# Altium schematic sheet Sheet1.SchDoc
size A; SheetNumber: 1; SheetTotal: 1
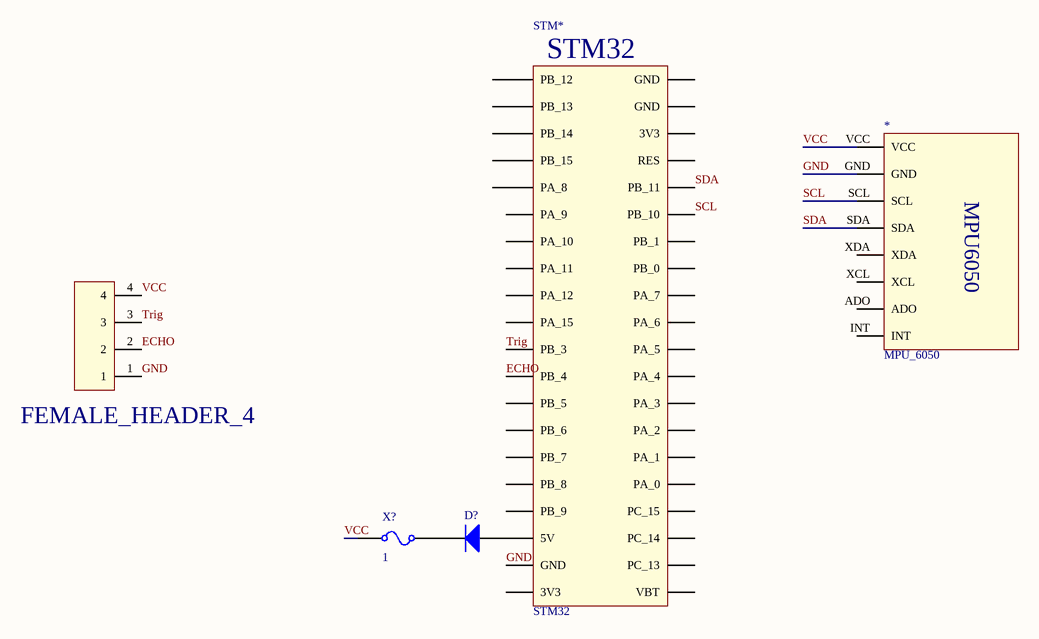
[diagram p0: Sheet1.SchDoc]

## Parts
*  MPU_6050  [MPU6050]
D?  Diode  (value not drawn)
STM*  STM32  [STM32]
X?  CURRENT: 1  (hidden comment: Fuse)
  FEMALE_HEADER_4  [Female_Header_4]

## Nets
ECHO: STM*.PB_4 .2
GND: *.GND STM*.GND .1
SCL: *.SCL STM*.PB_10
SDA: *.SDA STM*.PB_11
Trig: STM*.PB_3 .3
VCC: *.VCC X?.1 .4
NetD?_1: D?.1(A) STM*.5V
NetD?_2: D?.2(K) X?.2

Not connected (* = marked no-connect by the designer): * ADO INT XCL XDA; STM* 3V3 PA_0 PA_1 PA_2 PA_3 PA_4 PA_5 PA_6 PA_7 PA_8 PA_9 PA_10 PA_11 PA_12 PA_15 PB_0 PB_1 PB_5 PB_6 PB_7 PB_8 PB_9 PB_12 PB_13 PB_14 PB_15 PC_13 PC_14 PC_15 RES VBT

## Notes on the sheet
- (in symbol MPU_6050) MPU6050

## Library data of the parts
D? = Diode: AF: 1; BV: 0; BV_MAX: 1e99; EG: 1.11; FC: 0.5; IBV: 0.001; ISR: 1e-14; MJSW: 0.33; NTUN: 30; TNOM: 27; XTI: 3; SimulationGenericComponent: True; CJO: 0; CJP: 0; CTA: 0; CTP: 0; FCS: 0.5; FV_MAX: 1e99; IKF: 0; IKR: 0; JSW: 0; JTUN: 0; JTUNSW: 0; KEG: 1; KF: 0; LEVEL: 1; N: 1; NBV: 1; NR: 1; NS: 1; PHP: 1; RS: 0; TCV: 0; TLEV: 0; TLEVC: 0; TM1: 0; TM2: 0; TPB: 0; TPHP: 0; TRS: 0; TRS2: 0; TT: 0; TTT1: 0; TTT2: 0; VJ: 1; XTITUN: 3; IS: 1e-14
X? = Fuse: RESISTANCE: 1m; SimulationGenericComponent: True